# Altium schematic sheet buck3.SchDoc: Buck3
size A4
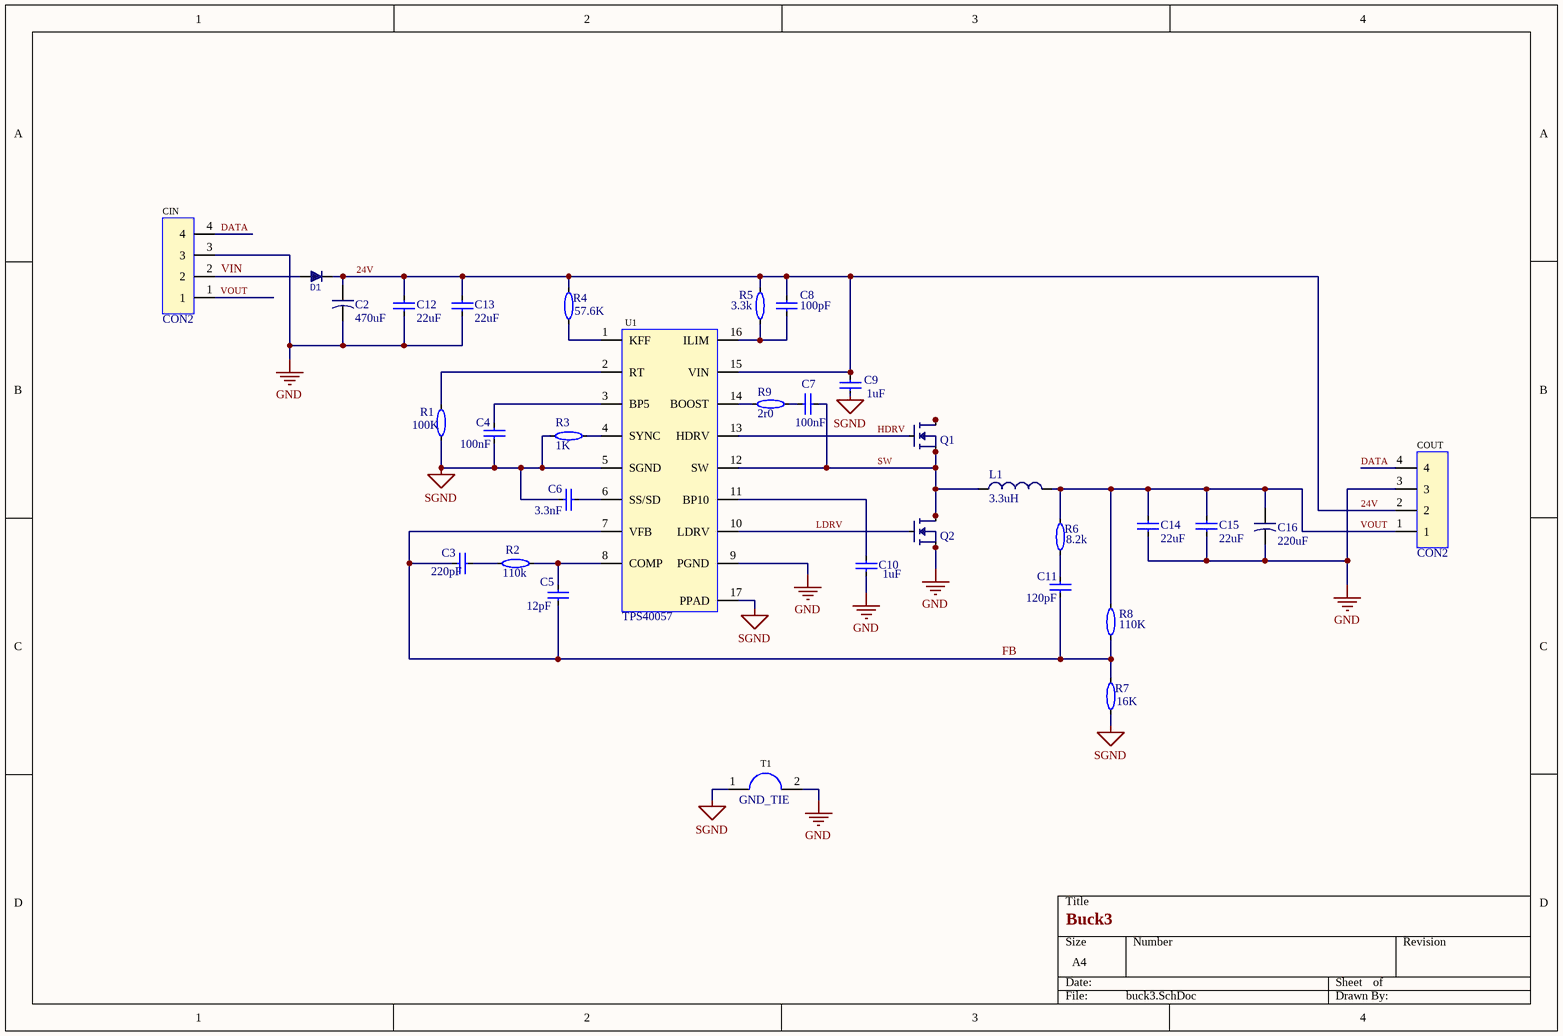
[diagram p0: buck3.SchDoc]

## Parts
C2  470uF  [CAPAE110103X125L]
C3  220pF  [CAPC 0603 1608X05L]
C4  100nF  [CAPC 0603 1608X05L]
C5  12pF  [CAPC 0603 1608X05L]
C6  3.3nF  [CAPC 0603 1608X05L]
C7  100nF  [CAPC 0603 1608X05L]
C8  100pF  [CAPC 0603 1608X05L]
C9  1uF  [CAPC 0603 1608X05L]
C10  1uF  [CAPC 0603 1608X05L]
C11  120pF  [CAPC 0603 1608X05L]
C12  22uF  [CAPC 1210]
C13  22uF  [CAPC 1210]
C14  22uF  [CAPC 1210]
C15  22uF  [CAPC 1210]
C16  220uF  [CAPAE110103X125L]
CIN  CON2  [CON2]  (no BOM)
COUT  CON2  [CON2]  (no BOM)
D1  DIODE  [SODFL350X110-2N]  (value not drawn)
L1  value 3.3uH  [INDP135126X40L]  (hidden comment: Inductor)
Q1  Infineon BSC093N04LSGATMA1  [INF-PG-TDSON-8-1_V]  (value not drawn)
Q2  Infineon BSC093N04LSGATMA1  [INF-PG-TDSON-8-1_V]  (value not drawn)
R1  100K  [RESC 0603 1608X05L]
R2  110k  [RESC 0603 1608X05L]
R3  1K  [RESC 0603 1608X05L]
R4  57.6K  [RESC 0603 1608X05L]
R5  3.3k  [RESC 0603 1608X05L]
R6  8.2k  [RESC 0603 1608X05L]
R7  16K  [RESC 0603 1608X05L]
R8  110K  [RESC 0603 1608X05L]
R9  2r0  [RESC 0603 1608X05L]
T1  GND_TIE  [GND_TIE]  (net tie, no BOM)
U1  TPS40057  [TSOP65P640X120_HS-17N]

## Nets
GND: C2.2 C10.1 C12.1 C13.1 C14.1 C15.1 C16.2 CIN.3 COUT.3 Q2.1(S) Q2.2(S) Q2.3(S) T1.2 U1.9(PGND)
SGND: C4.1 C6.1 C9.1 R1.1 R3.1 R7.1 T1.1 U1.5(SGND) U1.17(PPAD)
24V: C2.1 C8.2 C9.2 C12.2 C13.2 COUT.2 D1.1(CATHODE) R4.1 R5.1 U1.15(VIN)
DATA: CIN.4 COUT.4
FB: C3.2 C5.2 C11.2 R7.2 R8.1 U1.7(VFB)
HDRV: Q1.4(G) U1.13(HDRV)
LDRV: Q2.4(G) U1.10(LDRV)
SW: C7.1 L1.1 Q1.1(S) Q1.2(S) Q1.3(S) Q2.5(D) Q2.6(D) Q2.7(D) Q2.8 U1.12(SW)
VIN: CIN.2 D1.2(ANODE)
VOUT: C14.2 C15.2 C16.1 CIN.1 COUT.1 L1.2 R6.2 R8.2
NetC3_1: C3.1 R2.1
NetC4_2: C4.2 U1.3(BP5)
NetC5_1: C5.1 R2.2 U1.8(COMP)
NetC6_2: C6.2 U1.6(SS/SD)
NetC7_2: C7.2 R9.2
NetC8_1: C8.1 R5.2 U1.16(ILIM)
NetC10_2: C10.2 U1.11(BP10)
NetC11_1: C11.1 R6.1
NetQ1_5: Q1.5(D) Q1.6(D) Q1.7(D) Q1.8
NetR1_2: R1.2 U1.2(RT)
NetR3_2: R3.2 U1.4(SYNC)
NetR4_2: R4.2 U1.1(KFF)
NetR9_1: R9.1 U1.14(BOOST)

## Library data of the parts
C2 C16 = E CAP: Capacitor; ClassName: caps
  C2: Value: 470uF
  C16: Value: 220uF
C3-C15 = Cap: Capacitor; Published: 8-Jun-2000; LatestRevisionDate: 17-Jul-2002; LatestRevisionNote: Re-released for DXP Platform.; PackageReference: RAD-0.3; Publisher: Altium Limited; PackageDescription: Radial Cap, Thru-Hole; 2 Leads; 0.3 in Pin Spacing
  C3: Value: 220pF
  C4 C7: Value: 100nF
  C5: Value: 12pF
  C6: Value: 3.3nF
  C8: Value: 100pF
  C9 C10: Value: 1uF
  C11: Value: 120pF
  C12 C13: Value: 22uF
  C14 C15: Value: 22uF; ClassName: caps
L1 = Inductor: Code_IEC: 1005; Published: 8-Jun-2000; LatestRevisionDate: 29-May-2009; LatestRevisionNote: IPC-7351 Footprint Added.; PackageReference: 0402-A; Publisher: Altium Limited; PackageDescription: Chip Inductor; Code_JEITA: 0402
Q1 Q2 = MOSFET-N: N Channel MOSFET; Value: Infineon BSC093N04LSGATMA1
R1-R9 = Res2: Resistor; Published: 8-Jun-2000; LatestRevisionDate: 17-Jul-2002; LatestRevisionNote: Re-released for DXP Platform.; PackageReference: AXIAL-0.4; Publisher: Altium Limited; PackageDescription: Axial Device, Thru-Hole; 2 Leads; 0.4 in Pin Spacing
  R1: Value: 100K
  R2: Value: 110k
  R3: Value: 1K
  R4: Value: 57.6K
  R5: Value: 3.3k
  R6: Value: 8.2k
  R7: Value: 16K
  R8: Value: 110K
  R9: Value: 2r0
U1 = TPS40057: Buck Controller; Value: TPS40057